# Altium schematic sheet SampIO.SchDoc
size A4
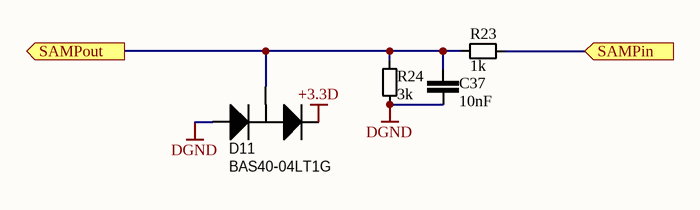
[diagram p0: SampIO.SchDoc]

## Parts
C37  value 10nF  [0603-C]  (hidden comment: Cap)
D11  BAS40-04LT1G  [SOT-23_N]
R23  value 1k  [0603-R]  (hidden comment: Res)
R24  value 3k  [0603-R]  (hidden comment: Res)

## Ports
SAMPin (in), SAMPout (out)

## Nets
+3.3D: D11.2(K)
DGND: C37.1 D11.1(A) R24.1
SAMPin: R23.2 ; port SAMPin
SAMPout: C37.2 D11.3(C) R23.1 R24.2 ; port SAMPout

## Library data of the parts
C37 = C21C010NK1H0: MLCC 10nF 10% 50V X7R 0603; TemperatureRange: -55°C to 150°C; VenderID: MLCC-0603-50V-103K-X7R; Published: 1-Jun-2017; Publisher: GreenBox; MountType: SMT; PackageReference: 0603; Manufacturer: *
D11 = D742BAS4004O: Dual Series Schottky Barrier Diode BAS40-04LT1G Vrrm 40V If 0.12A Ir 1uA; Manufacturer: ON SEMICONDUCTOR; TemperatureRange: -55 to 150°C; MountType: SMT; PackageReference: SOT-23; Published: 1-Jun-2017; Publisher: GreenBox; VenderID: BAS40-04LT1G
R23 = R11C001KFBF0: SMD Resistor 1k 1% 1/10W 0603 100PPM; TemperatureRange: -55°C to 150°C; VenderID: RES-0603-1k-1%; Published: 1-Jun-2017; Publisher: GreenBox; MountType: SMT; PackageReference: 0603; Manufacturer: *
R24 = R11C003KFBF0: SMD Resistor 3k 1% 1/10W 0603 100PPM; TemperatureRange: -55°C to 150°C; VenderID: RES-0603-3k-1%; Published: 1-Jun-2017; Publisher: GreenBox; MountType: SMT; PackageReference: 0603; Manufacturer: *